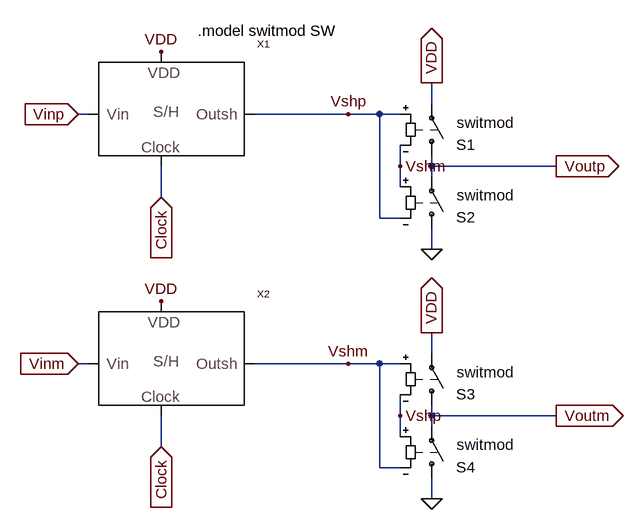
[diagram p0: schematic Ideal_differential_clocked_comparator.asc]
Ideal_differential_clocked_comparator.asc, the LTspice schematic file:
Version 4
SHEET 1 6308 720
WIRE 1072 80 1056 80
WIRE 1072 464 1056 464
WIRE 1184 208 1184 160
WIRE 1184 592 1184 544
WIRE 1472 80 1328 80
WIRE 1472 464 1328 464
WIRE 1520 80 1472 80
WIRE 1520 240 1520 80
WIRE 1520 464 1472 464
WIRE 1520 624 1520 464
WIRE 1552 80 1520 80
WIRE 1552 160 1552 128
WIRE 1552 192 1552 160
WIRE 1552 240 1520 240
WIRE 1552 464 1520 464
WIRE 1552 544 1552 512
WIRE 1552 576 1552 544
WIRE 1552 624 1520 624
WIRE 1600 64 1600 32
WIRE 1600 160 1600 144
WIRE 1600 176 1600 160
WIRE 1600 288 1600 256
WIRE 1600 448 1600 416
WIRE 1600 544 1600 528
WIRE 1600 560 1600 544
WIRE 1600 672 1600 640
WIRE 1792 160 1600 160
WIRE 1792 544 1600 544
FLAG 1600 32 VDD
IOPIN 1600 32 Out
FLAG 1600 288 0
FLAG 1056 80 Vinp
IOPIN 1056 80 In
FLAG 1792 160 Voutp
IOPIN 1792 160 Out
FLAG 1184 -16 VDD
FLAG 1184 208 Clock
IOPIN 1184 208 In
FLAG 1472 80 Vshp
FLAG 1600 416 VDD
IOPIN 1600 416 Out
FLAG 1600 672 0
FLAG 1792 544 Voutm
IOPIN 1792 544 Out
FLAG 1472 464 Vshm
FLAG 1552 544 Vshp
FLAG 1552 160 Vshm
FLAG 1056 464 Vinm
IOPIN 1056 464 In
FLAG 1184 368 VDD
FLAG 1184 592 Clock
IOPIN 1184 592 In
SYMBOL sw 1600 160 M180
WINDOW 3 24 -12 Left 0
WINDOW 38 39 67 Left 0
WINDOW 0 38 33 Left 0
SYMATTR Value ""
SYMATTR SpiceModel switmod
SYMATTR InstName S1
SYMBOL sw 1600 272 M180
WINDOW 3 24 -12 Left 0
WINDOW 38 39 67 Left 0
WINDOW 0 38 33 Left 0
SYMATTR Value ""
SYMATTR SpiceModel switmod
SYMATTR InstName S2
SYMBOL Sample_and_hold 1088 144 R0
SYMATTR InstName X1
SYMBOL sw 1600 544 M180
WINDOW 3 24 -12 Left 0
WINDOW 38 39 67 Left 0
WINDOW 0 38 33 Left 0
SYMATTR Value ""
SYMATTR SpiceModel switmod
SYMATTR InstName S3
SYMBOL sw 1600 656 M180
WINDOW 3 24 -12 Left 0
WINDOW 38 39 67 Left 0
WINDOW 0 38 33 Left 0
SYMATTR Value ""
SYMATTR SpiceModel switmod
SYMATTR InstName S4
SYMBOL Sample_and_hold 1088 528 R0
SYMATTR InstName X2
TEXT 1240 -48 Left 0 !.model switmod SW

The netlist it stands for:
* Ideal_differential_clocked_comparator.asc
S1 Voutp VDD Vshp Vshm switmod
S2 0 Voutp Vshm Vshp switmod
XX1 Vinp Vshp Clock VDD Sample_and_hold  ; pins Vin Outsh Clock VDD
S3 Voutm VDD Vshm Vshp switmod
S4 0 Voutm Vshp Vshm switmod
XX2 Vinm Vshm Clock VDD Sample_and_hold  ; pins Vin Outsh Clock VDD
.model switmod SW
.backanno
.end